# EasyEDA Pro project USBHead.epro

# Schematic Schematic1
Board Name: Board1; Create Date: 2026-05-22; Page Name: P1; Project Name: USB_hub; Schematic Name: Schematic1; Update Date: 2026-06-10; Company: EasyEDA.com; Page Size: A4; Version: V1.0
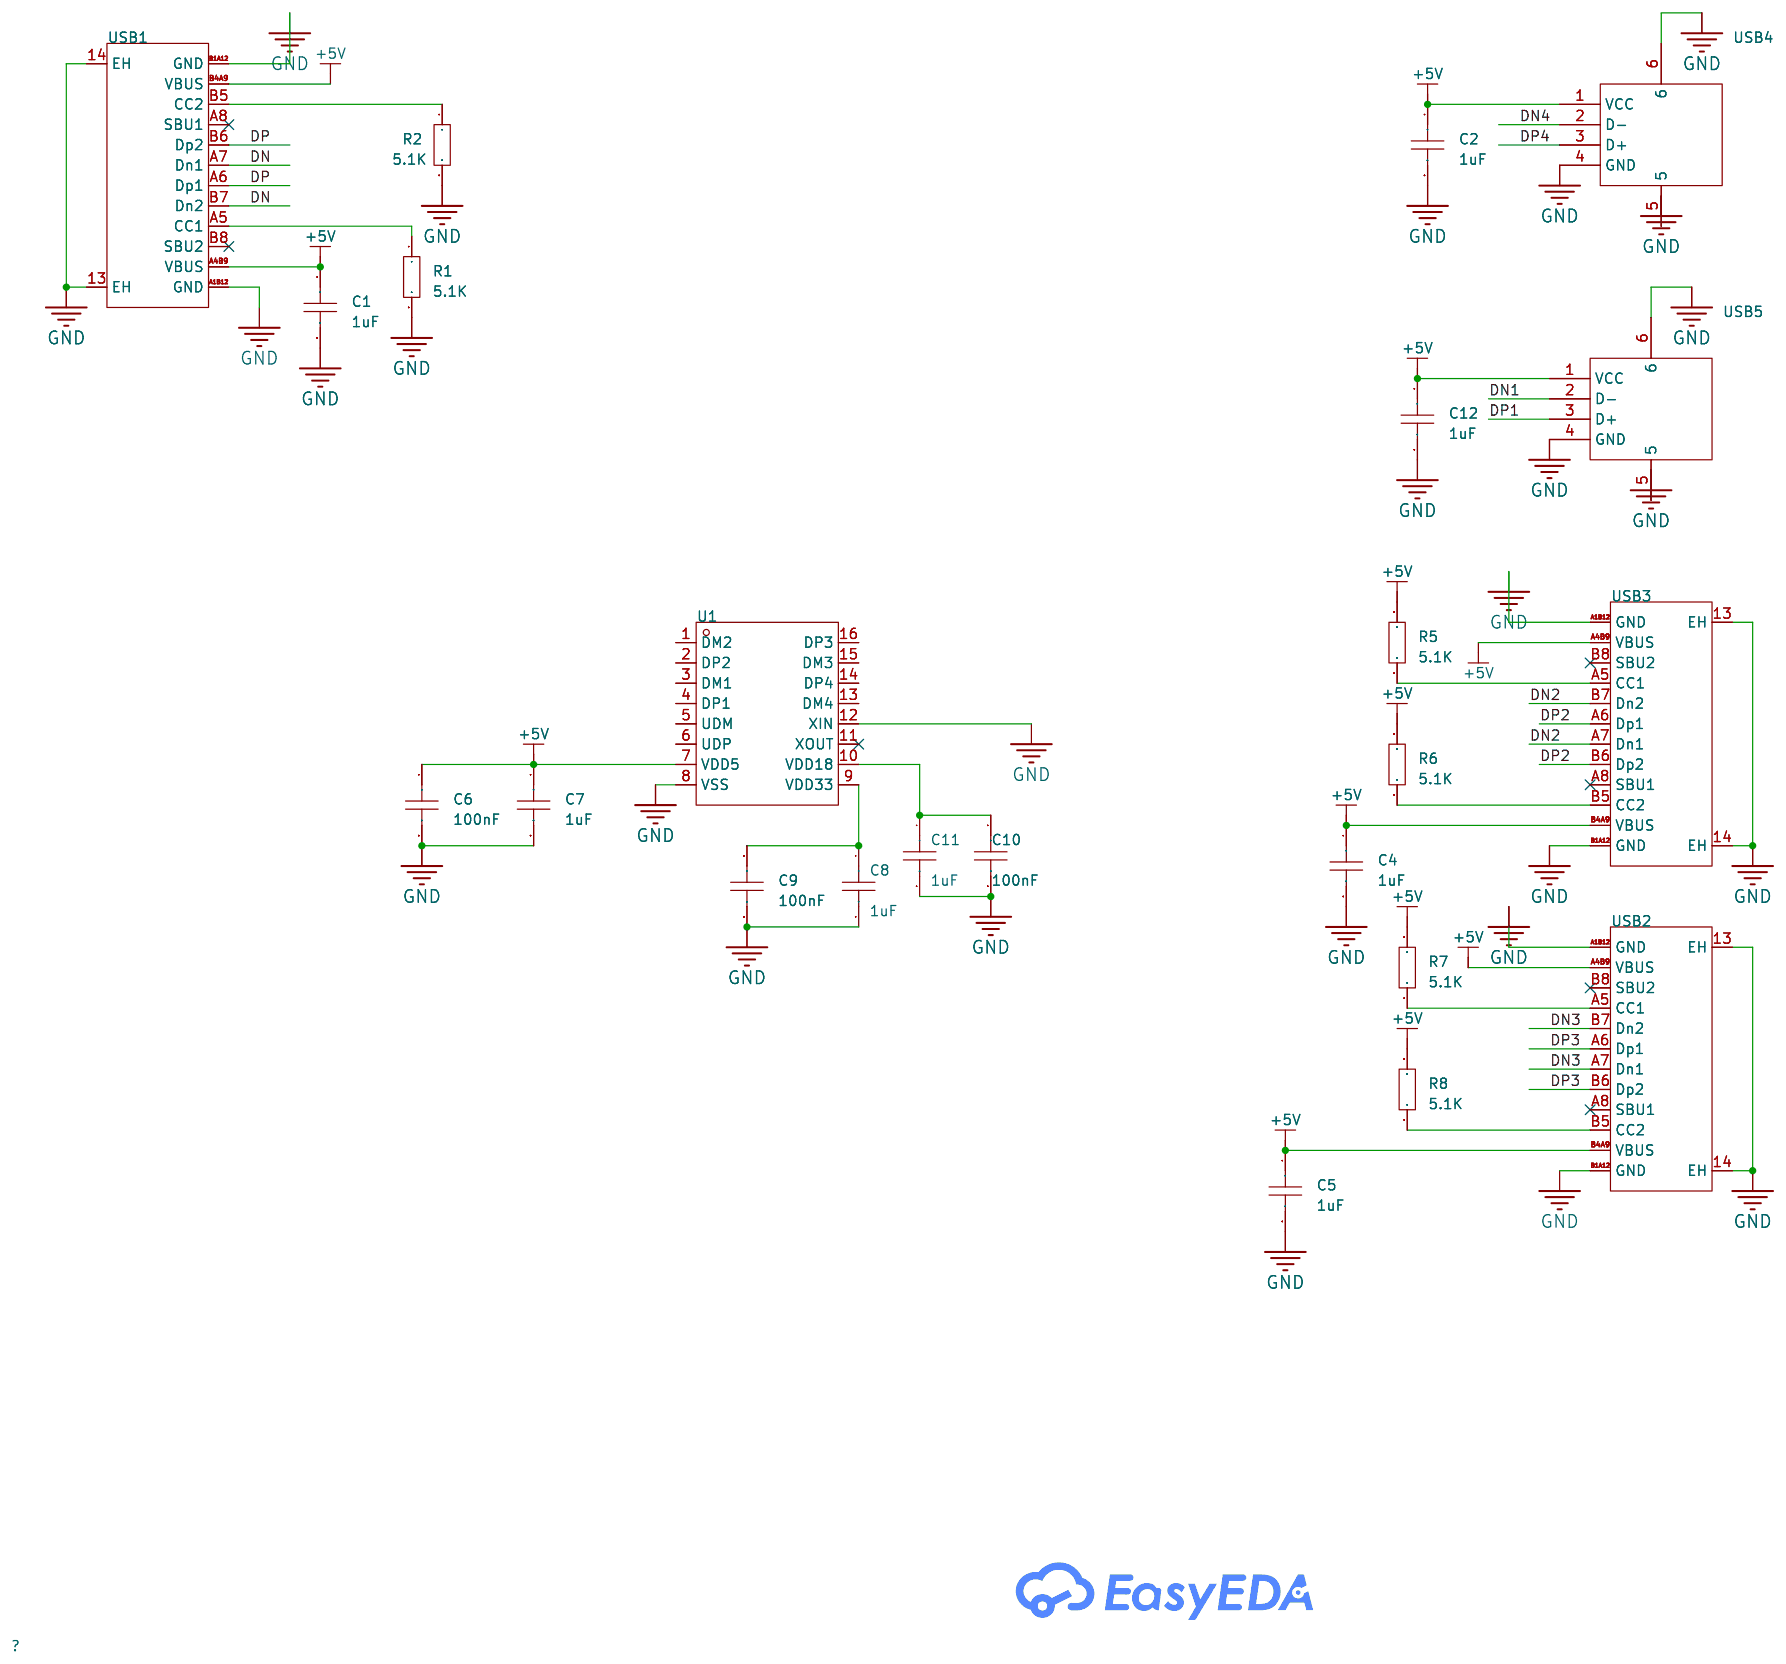
[diagram p0: schematic sheet]

## Parts
C1  1uF  [C0603]
C2  1uF  [C0603]
C4  1uF  [C0603]
C5  1uF  [C0603]
C6  100nF  [C0603]
C7  1uF  [C0603]
C8  1uF  [C0603]
C9  100nF  [C0603]
C10  100nF  [C0603]
C11  1uF  [C0603]
C12  1uF  [C0603]
R1  5.1K  [R0603]
R2  5.1K  [R0603]
R5  5.1K  [R0603]
R6  5.1K  [R0603]
R7  5.1K  [R0603]
R8  5.1K  [R0603]
U1  SL2.1s  [SSOP-16_L4.6-W2.6-P0.53-LS4.0-BL]
USB1  TYPE-C 16PIN 2MD(073)  [USB-C-SMD_TYPE-C-16PIN-2MD-073]
USB2  TYPE-C 16PIN 2MD(073)  [USB-C-SMD_TYPE-C-16PIN-2MD-073]
USB3  TYPE-C 16PIN 2MD(073)  [USB-C-SMD_TYPE-C-16PIN-2MD-073]
USB4  10.0 QHHTZB6.3  [USB-A-TH_10.0QHHTZB6.3]
USB5  10.0 QHHTZB6.3  [USB-A-TH_10.0QHHTZB6.3]

## Library data of the parts
C1 C2 C4-C12 = CAP_0603: Supplier Footprint: 0603
R1 R2 R5-R8 = Res_0603: Supplier Footprint: 0603
U1 = SL2.1s: type:Hub USB Protocol:USB 2.0 Data Rate:- Voltage - Supply:4V~5.25V Voltage - Supply:4V~5.25V Operating Temperature:0℃~+70℃ Operating Temperature:0℃~+70℃ Memory Interface:- Current - Supply:120mA Quiescent Supply Current:2.5mA Number of Channels:4; LCSC Part Name: USB2.0 HUB控制器集成电路; Supplier Part: C2684433; Manufacturer: CoreChips(和芯润德); Supplier Footprint: SSOP-16; JLCPCB Part Class: Extended Part; Datasheet: https://item.szlcsc.com/datasheet/SL2.1s/2782346.html; Supplier: LCSC; type: Hub; USB Protocol: USB 2.0; Voltage - Supply: 4V~5.25V; Operating Temperature: 0℃~+70℃; Current - Supply: 120mA; Quiescent Supply Current: 2.5mA; Number of Channels: 4
USB1-USB3 = TYPE-C 16PIN 2MD(073): Connector Type:Type-C Protocol Standard:- Gender:Female Mounting Type:Surface Mount, Right Angle Number of Contacts:16P Number of Ports:1 Current Rating-Power:3A Voltage Rating:5V Connect-Disconnect Life:10,000 Cycles Supplementary Features:- Center Heigh; LCSC Part Name: Type-C 母 卧贴; Supplier Part: C2765186; Manufacturer: SHOU HAN(首韩); Supplier Footprint: SMD; JLCPCB Part Class: Extended Part; Datasheet: https://item.szlcsc.com/datasheet/TYPE-C%252016PIN%25202MD(073)/2901843.html; Supplier: LCSC; Connector Type: Type-C; Gender: Female; Mounting Type: Surface Mount, Right Angle; Number of Contacts: 16P; Number of Ports: 1; Current Rating-Power: 3A; Voltage Rating: 5V; Connect-Disconnect Life: 10,000 Cycles; Detection color: Black; Operating Temperature: -25℃~+85℃
USB4 USB5 = 10.0 QHHTZB6.3: Connector Type:Type-A Protocol Standard:USB 2.0 Gender:Female Mounting Type:Surface Mount, Right Angle Number of Contacts:4P Number of Ports:1 Current Rating-Power:1.5A Voltage Rating:30V Connect-Disconnect Life:5,000 times Supplementary Features:- Center; LCSC Part Name: 壳长10.0mm; Supplier Part: C668591; Manufacturer: SHOU HAN(首韩); Supplier Footprint: SMD; JLCPCB Part Class: Extended Part; Datasheet: https://item.szlcsc.com/datasheet/10.0%2520QHHTZB6.3/698534.html; Supplier: LCSC; Connector Type: Type-A; Protocol Standard: USB 2.0; Gender: Female; Mounting Type: Surface Mount, Right Angle; Number of Contacts: 4P; Number of Ports: 1; Current Rating-Power: 1.5A; Voltage Rating: 30V; Connect-Disconnect Life: 5,000 times; Length: 10mm; Detection color: Black; Operating Temperature: -25℃~+85℃

## Nets
+5V: C1.1 C2.1 C4.1 C5.1 C6.1 C7.1 C12.1 R5.2 R6.2 R7.2 R8.2 U1.7(VDD5) USB1.A4B9(VBUS) USB1.B4A9(VBUS) USB2.A4B9(VBUS) USB2.B4A9(VBUS) USB3.A4B9(VBUS) USB3.B4A9(VBUS) USB4.1(VCC) USB5.1(VCC)
GND: C1.2 C2.2 C4.2 C5.2 C6.2 C7.2 C8.2 C9.2 C10.2 C11.2 C12.2 R1.2 R2.2 U1.8(VSS) U1.12(XIN) USB1.13(EH) USB1.14(EH) USB1.A1B12(GND) USB1.B1A12(GND) USB2.13(EH) USB2.14(EH) USB2.A1B12(GND) USB2.B1A12(GND) USB3.13(EH) USB3.14(EH) USB3.A1B12(GND) USB3.B1A12(GND) USB4.4(GND) USB4.5 USB4.6 USB5.4(GND) USB5.5 USB5.6
DN: USB1.A7(Dn1) USB1.B7(Dn2)
DN1: USB5.2(D-)
DN2: USB3.A7(Dn1) USB3.B7(Dn2)
DN3: USB2.A7(Dn1) USB2.B7(Dn2)
DN4: USB4.2(D-)
DP: USB1.A6(Dp1) USB1.B6(Dp2)
DP1: USB5.3(D+)
DP2: USB3.A6(Dp1) USB3.B6(Dp2)
DP3: USB2.A6(Dp1) USB2.B6(Dp2)
DP4: USB4.3(D+)
$1N927: R1.1 USB1.A5(CC1)
$1N932: R2.1 USB1.B5(CC2)
$1N2249: R5.1 USB3.A5(CC1)
$1N2253: R6.1 USB3.B5(CC2)
$1N2258: R7.1 USB2.A5(CC1)
$1N2264: R8.1 USB2.B5(CC2)
$1N2890: C8.1 C9.1 U1.9(VDD33)
$1N3002: C10.1 C11.1 U1.10(VDD18)

Not connected (* = marked no-connect by the designer): U1 1(DM2) 2(DP2) 3(DM1) 4(DP1) 5(UDM) 6(UDP) 11(XOUT)* 13(DM4) 14(DP4) 15(DM3) 16(DP3); USB1 A8(SBU1)* B8(SBU2)*; USB2 A8(SBU1)* B8(SBU2)*; USB3 A8(SBU1)* B8(SBU2)*

# Board PCB1
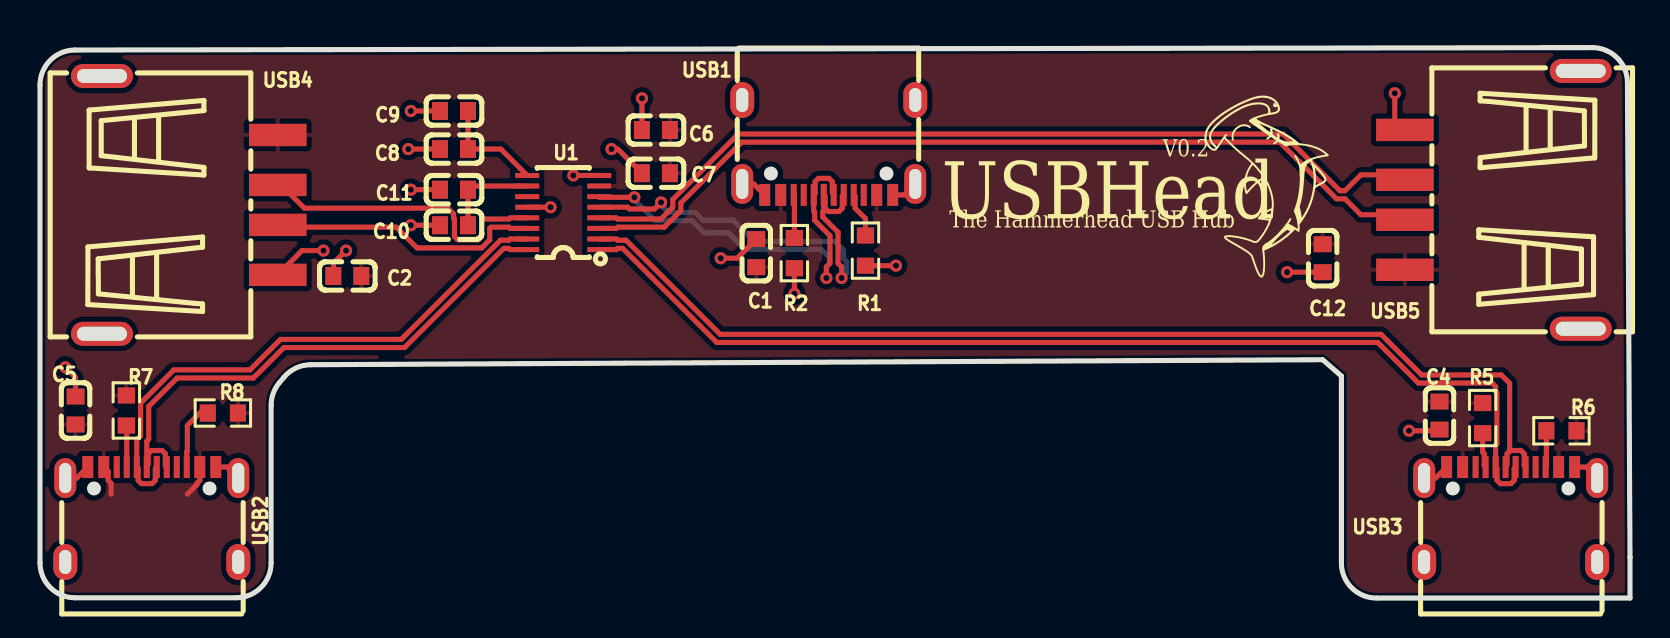
[diagram p1: board, top side]
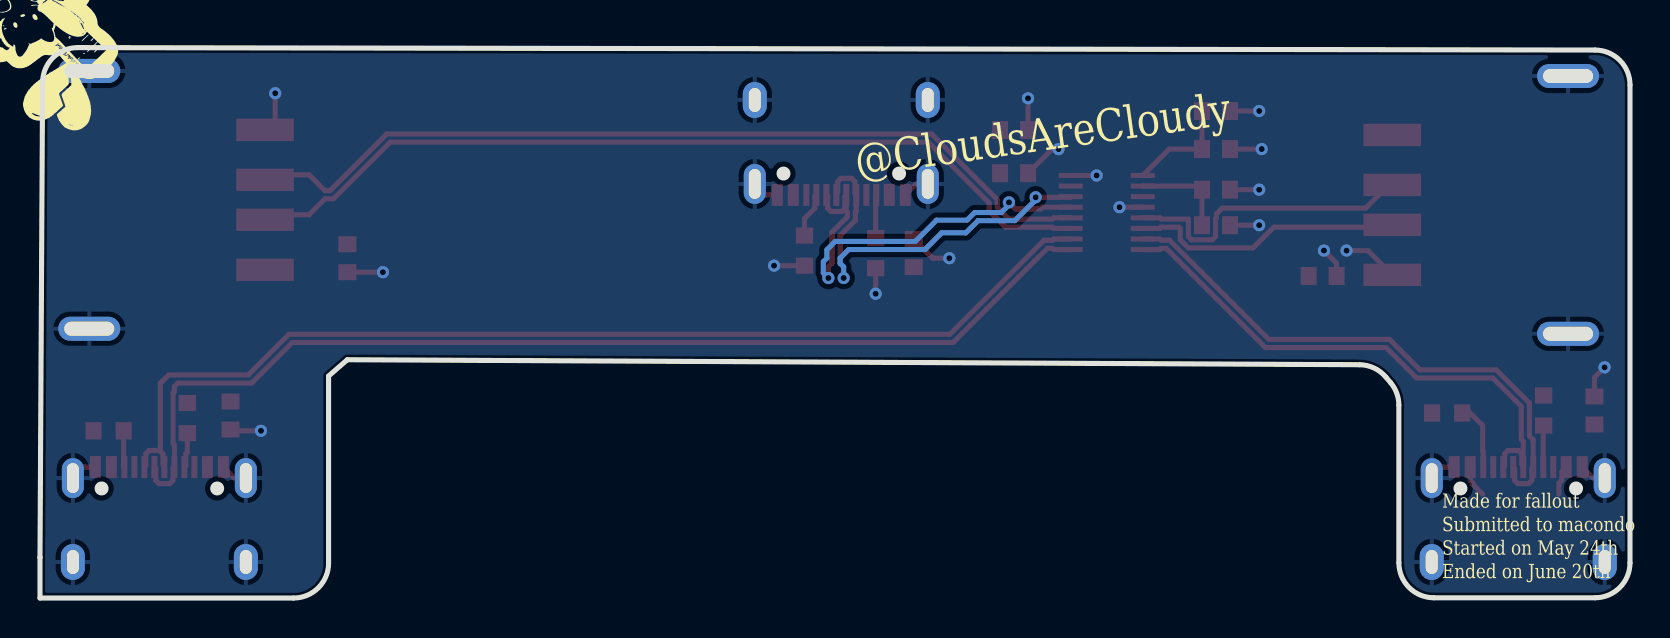
[diagram p2: board, bottom side, seen from below]

Outline 79.5 x 27.54 mm; copper layers: Top Layer, Bottom Layer. Coordinates in mm from the lower left corner of the outline.
Outline path: 0,25.67 arc(0.51,26.91) 1.75,27.42 77.62,27.54 arc(78.86,27.04) 79.37,25.8 79.5,2.04 arc(79.5,2.04) 79.5,2.03 79.5,0 66.82,0 arc(65.59,0.51) 65.07,1.75 65.07,11.11 64.14,11.93 13.53,11.68 arc(12.8,11.51) 12.2,11.06 11.97,10.78 arc(11.66,10.25) 11.56,9.65 11.56,1.76 arc(11.04,0.53) 9.81,0.01 1.75,0.01 arc(0.51,0.53) 0,1.76 0,25.67
Stack: Top Layer 0.035mm / Dielectric1 1.51mm FR4 er 4.5 / Bottom Layer 0.035mm

## Design rules (mm)
net DN2: DP2
net DP2: DP2
net DN1: DP4
net DP1: DP4
net DN: DP1
net DP: DP1
net DN4: DP5
net DP4: DP5
net DN3: DP3
net DP3: DP3
template: Custom Config
spacing copperThickness1oz (default): track to track 0.102, other pairs 0.152 to 0.3
spacing copperThickness2oz: track to track 0.203, other pairs 0.152 to 0.3
track width copperThickness1oz (default): min 0.127, default 0.254, max 2.54
track width copperThickness2oz: min 0.203, default 0.254, max 2.54
differential pair differentialPair (default): width min 0.127, default 0.254, max 2.54; gap min 0.152, default 0.152
via viaSize (default): diameter min 0.5, default 0.61, max 10; hole min 0.3, default 0.305, max 6.3

## Placement (name value [footprint] x y rotation side)
C1  1uF  [C0603]  35.81 17.26 90 top
C2  1uF  [C0603]  15.37 16.12 180 top
C4  1uF  [C0603]  69.98 9.13 270 top
C5  1uF  [C0603]  1.78 9.39 90 top
C6  100nF  [C0603]  30.8 23.42 180 top
C7  1uF  [C0603]  30.8 21.26 180 top
C8  1uF  [C0603]  20.7 22.47 180 top
C9  100nF  [C0603]  20.7 24.37 180 top
C10  100nF  [C0603]  20.7 18.66 180 top
C11  1uF  [C0603]  20.7 20.43 180 top
C12  1uF  [C0603]  64.14 17.01 270 top
R1  5.1K  [R0603]  41.27 17.39 270 top
R2  5.1K  [R0603]  37.72 17.26 270 top
R5  5.1K  [R0603]  72.14 9 90 top
R6  5.1K  [R0603]  76.07 8.37 0 top
R7  5.1K  [R0603]  4.32 9.39 90 top
R8  5.1K  [R0603]  9.14 9.26 0 top
U1  SL2.1s  [SSOP-16_L4.6-W2.6-P0.53-LS4.0-BL]  26.16 19.29 90 top
USB1  TYPE-C 16PIN 2MD(073)  [USB-C-SMD_TYPE-C-16PIN-2MD-073]  39.44 22.55 180 top
USB2  TYPE-C 16PIN 2MD(073)  [USB-C-SMD_TYPE-C-16PIN-2MD-073]  5.59 4.18 0 top
USB3  TYPE-C 16PIN 2MD(073)  [USB-C-SMD_TYPE-C-16PIN-2MD-073]  73.53 4.18 0 top
USB4  10.0 QHHTZB6.3  [USB-A-TH_10.0QHHTZB6.3]  7.49 19.67 270 top
USB5  10.0 QHHTZB6.3  [USB-A-TH_10.0QHHTZB6.3]  72.64 19.93 90 top

## Footprints (pads in the part's own frame, mm; a bottom-side part is the same pattern mirrored in y, then rotated)
C0603
  rect 0.8x0.9 smd: 1(-0.7,0) 2(0.7,0)
R0603
  rect 0.806x0.864 smd: 1(-0.753,0) 2(0.753,0)
SSOP-16_L4.6-W2.6-P0.53-LS4.0-BL
  rect 0.25x1.2 smd: 1(-1.855,-1.8) 2(-1.325,-1.8) 3(-0.795,-1.8) 4(-0.265,-1.8) 5(0.265,-1.8) 6(0.795,-1.8) 7(1.325,-1.8) 8(1.855,-1.8) 9(1.855,1.8) 10(1.325,1.8) 11(0.795,1.8) 12(0.265,1.8) 13(-0.265,1.8) 14(-0.795,1.8) 15(-1.325,1.8) 16(-1.855,1.8)
USB-A-TH_10.0QHHTZB6.3
  rect 1.12x2.88 smd: 1(-3.5,4.395) 2(-1,4.395) 3(1,4.395) 4(3.5,4.395)
  oval 1.2x3.1 hole 0.7x2.5: 5(-6.45,-4.395) 6(6.45,-4.395)
USB-C-SMD_TYPE-C-16PIN-2MD-073
  oval 1.1x2 hole 0.6x1.5: 13(-4.325,1.825) 14(4.325,1.825)
  oval 1.2x1.8 hole 0.6x1.2: 13(-4.325,-2.375) 14(4.325,-2.375)
  rect 0.55x1.1 smd: A1B12(-3.2,2.375) A4B9(-2.4,2.375) B1A12(3.2,2.375) B4A9(2.4,2.375)
  rect 0.3x1.1 smd: A5(-1.25,2.375) A6(-0.25,2.375) A7(0.25,2.375) A8(1.25,2.375) B5(1.75,2.375) B6(0.75,2.375) B7(-0.75,2.375) B8(-1.75,2.375)

## Nets
+5V: C1.1 C2.1 C4.1 C5.1 C6.1 C7.1 C12.1 R5.2 R6.2 R7.2 R8.2 U1.7 USB1.A4B9 USB1.B4A9 USB2.A4B9 USB2.B4A9 USB3.A4B9 USB3.B4A9 USB4.1 USB5.1
GND: C1.2 C2.2 C4.2 C5.2 C6.2 C7.2 C8.2 C9.2 C10.2 C11.2 C12.2 R1.2 R2.2 U1.8 U1.12 USB1.13 USB1.14 USB1.A1B12 USB1.B1A12 USB2.13 USB2.14 USB2.A1B12 USB2.B1A12 USB3.13 USB3.14 USB3.A1B12 USB3.B1A12 USB4.4 USB4.5 USB4.6 USB5.4 USB5.5 USB5.6
DN: U1.5 USB1.A7 USB1.B7
DN1: U1.3 USB5.2
DN2: U1.1 USB3.A7 USB3.B7
DN3: U1.15 USB2.A7 USB2.B7
DN4: U1.13 USB4.2
DP: U1.6 USB1.A6 USB1.B6
DP1: U1.4 USB5.3
DP2: U1.2 USB3.A6 USB3.B6
DP3: U1.16 USB2.A6 USB2.B6
DP4: U1.14 USB4.3
$1N927: R1.1 USB1.A5
$1N932: R2.1 USB1.B5
$1N2249: R5.1 USB3.A5
$1N2253: R6.1 USB3.B5
$1N2258: R7.1 USB2.A5
$1N2264: R8.1 USB2.B5
$1N2890: C8.1 C9.1 U1.9
$1N3002: C10.1 C11.1 U1.10

Pads without a net: U1 11; USB1 A8 B8; USB2 A8 B8; USB3 A8 B8

## Via types
v1: diameter 0.61, hole 0.305, Top Layer to Bottom Layer, 21 vias

## Routing (per net, layer and track width the routed paths; a pad name or vN(x,y) marks a point on that pad's centre or on a via; arc(x,y) is an arc through that point)
+5V: length 3.1
  Top Layer w0.254: 7.37,5.19 7.85,5.68 7.85,5.74 7.99,5.88 USB2.B4A9 ; 3.56,5.19 3.56,5.74 3.41,5.89 3.41,6.33 USB2.A4B9
GND: length 36.2
  Top Layer w0.254: 70.17,8.37 v1(68.45,8.37) ; v1(1.27,11.54) 1.78,11.04 C5.2 ; USB4.4 13.1,17.39 v1(14.17,17.39) ; 30.1,23.42 v1(30.1,25.01) ; 20,20.43 v1(18.54,20.43) ; 67.74,23.68 v1(67.74,25.26) ; 20,24.37 v1(18.54,24.37) ; USB1.13 43.21,20.17 USB1.A1B12 ; USB3.B1A12 77.31,6.55 USB3.14 ; v1(34.04,17.01) 34.86,17.01 C1.2 ; U1.8 v1(26.67,21.15) ; 14.67,16.12 14.68,16.1 14.68,16.76 v1(15.3,17.39) ; v1(28.58,22.47) 28.89,22.47 C7.2 ; USB1.B1A12 35.69,20.72 USB1.14 ; R1.2 v1(42.8,16.63) ; 20,22.47 v1(18.41,22.47) ; USB2.13 1.84,6 USB2.A1B12 ; R2.2 v1(37.72,15.23) ; 20,18.66 v1(18.54,18.66) ; U1.12 v1(25.53,19.56) ; USB2.14 9.36,6.55 USB2.B1A12 ; USB3.13 69.78,6 70.33,6.55 ; C12.2 v1(62.36,16.31)
DN: length 22
  Top Layer w0.254: U1.5 29.39,19.56 29.48,19.47 30.72,19.47 v1(31.05,19.8) ; v1(40.08,16.01) 40.08,16.57 39.9,16.75 39.9,18.3 39.14,19.07 39.14,19.32 39.19,19.37 USB1.A7 39.26,20.1 39.26,19.51 39.42,19.34 39.95,19.34 40.12,19.51 40.12,20.1 USB1.B7
  Bottom Layer w0.254: v1(31.05,19.8) 31.05,19.67 31.44,19.29 32.77,19.29 33.15,18.91 34.67,18.91 35.74,17.85 39.74,17.85 40.16,17.43 40.16,17.01 40.33,16.83 40.33,16.27 v1(40.08,16.01)
DN1: length 43.3
  Top Layer w0.254: U1.3 28.82,18.5 28.88,18.56 31.21,18.56 32.05,19.39 32.05,19.77 35.09,22.81 61.99,22.81 64.83,19.98 65.25,19.98 66.05,19.18 67.74,19.18
DN2: length 54.2
  Top Layer w0.254: USB3.A7 73.71,6.48 73.71,5.89 73.55,5.72 73.02,5.72 72.85,5.89 72.85,6.48 USB3.B7 72.78,7.67 72.85,7.73 72.85,10.28 72.78,10.34 72.78,10.58 72.6,10.76 68.92,10.76 66.89,12.79 33.84,12.79 29.13,17.5 28.88,17.5 28.82,17.44 U1.1
DN3: length 28.4
  Top Layer w0.254: U1.15 23.51,17.97 23.45,17.91 23.02,17.91 18.06,12.94 12.02,12.94 10.5,11.42 6.69,11.42 5.03,9.76 5.03,8.11 4.84,7.92 USB2.B7 4.91,6.48 4.91,5.89 5.07,5.72 5.6,5.72 5.77,5.89 5.77,6.48 USB2.A7
DN4: length 15.2
  Top Layer w0.254: USB4.2 12.06,20.67 13.22,19.51 20.39,19.51 20.68,19.22 20.68,19.01 20.72,18.96 20.72,18.09 20.89,17.93 21.92,17.93 22.08,18.09 22.08,18.96 23.45,18.96 23.51,19.03 U1.13
DP: length 20.9
  Top Layer w0.254: U1.6 27.99,20.05 v1(29.72,20.05) ; v1(39.32,16.01) 39.32,16.57 39.5,16.75 39.5,18.14 38.73,18.9 38.73,19.32 38.69,19.37 USB1.B6 38.76,20.24 38.76,20.84 38.92,21 39.45,21 39.62,20.84 39.62,20.32 39.66,20.27 39.66,20.19 USB1.A6
  Bottom Layer w0.254: v1(39.32,16.01) 39.32,16.57 39.5,16.75 39.5,17.01 39.06,17.44 35.25,17.44 34.42,18.28 33.21,18.28 32.6,18.89 30.76,18.89 29.72,19.93 v1(29.72,20.05)
DP1: length 43.3
  Top Layer w0.254: U1.4 28.82,19.03 28.88,18.96 31.05,18.96 31.64,19.56 31.64,19.94 34.92,23.22 62.16,23.22 65,20.38 65.25,20.38 66.05,21.18 67.74,21.18
DP2: length 54.3
  Top Layer w0.254: 73.48,7.35 73.35,7.22 73.35,6.7 73.31,6.65 73.31,6.58 USB3.A6 ; 73.48,7.35 73.52,7.38 74.05,7.38 74.21,7.22 74.21,6.62 USB3.B6 ; 73.48,7.35 73.48,10.75 73.07,11.16 69.09,11.16 67.06,13.2 34.01,13.2 29.3,17.91 28.88,17.91 28.82,17.97 U1.2
DP3: length 27.7
  Top Layer w0.254: USB2.B6 6.27,6.62 6.27,7.22 6.1,7.38 5.57,7.38 5.41,7.22 5.41,6.7 5.36,6.65 5.36,6.58 USB2.A6 5.34,7.85 5.44,7.95 5.44,9.59 6.86,11.01 10.67,11.01 12.19,12.54 18.23,12.54 23.19,17.5 23.45,17.5 23.51,17.44 U1.16
DP4: length 13.7
  Top Layer w0.254: U1.14 23.51,18.5 23.45,18.56 22.55,18.56 22.49,18.5 22.49,17.92 22.08,17.52 18.85,17.52 17.81,18.56 12,18.56 USB4.3
$1N927: length 2.3
  Top Layer w0.254: R1.1 41.27,18.99 40.76,19.51 40.76,20.1 USB1.A5
$1N932: length 2.2
  Top Layer w0.254: USB1.B5 37.72,20.14 R2.1
$1N2249: length 1.8
  Top Layer w0.254: R5.1 72.14,7.3 72.21,7.22 72.21,6.62 USB3.A5
$1N2253: length 1.8
  Top Layer w0.254: USB3.B5 75.32,6.59 R6.1
$1N2258: length 2.1
  Top Layer w0.254: USB2.A5 4.34,8.61 R7.1
$1N2264: length 3.3
  Top Layer w0.254: USB2.B5 7.34,7.32 7.37,7.34 7.37,8.63 8.25,9.52
$1N2890: length 5.4
  Top Layer w0.254: C9.1 C8.1 23.04,22.47 U1.9
$1N3002: length 4.8
  Top Layer w0.254: 24.36,20.62 21.58,20.62 C11.1 C10.1

## Copper pours and planes (outline as drawn; the poured copper is in the pictures)
+5V on Top Layer: 0.13,29.71 79.63,29.71 79.63,-3.82 0.13,-3.82
GND on Bottom Layer: 0.25,28.94 79.5,28.94 79.5,-3.44 0.25,-3.44

## Text on the board
Bottom Silkscreen Layer: Made for fallout / Submitted to macondo / Started on May 24th / Ended on June 20th | @CloudsAreCloudy
Top Silkscreen Layer: The Hammerhead USB Hub | V0.2 | USBHead
